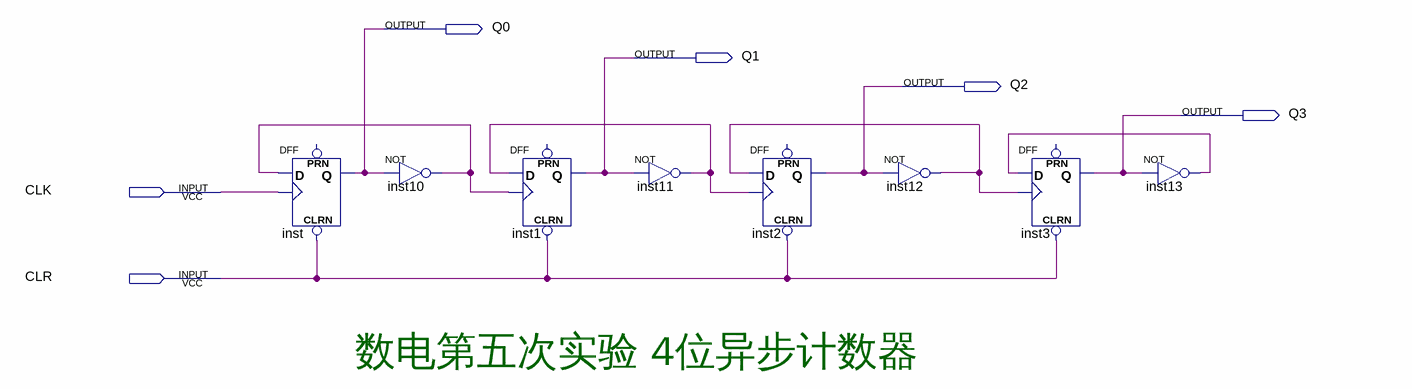
[diagram p0: schematic sheet]
// Quartus schematic 4bitybjsq.bdf as structural Verilog: 8 symbols, 6 pins
module \4bitybjsq  (
  input  CLK,
  input  CLR,
  output Q0,
  output Q1,
  output Q2,
  output Q3
);

  wire inst10_out, inst11_out, inst12_out, inst13_out;

  DFF inst (.CLRN(CLR), .CLK(CLK), .D(inst10_out), .Q(Q0));  // open: PRN
  not inst10 (inst10_out, Q0);
  DFF inst1 (.CLRN(CLR), .CLK(inst10_out), .D(inst11_out), .Q(Q1));  // open: PRN
  not inst11 (inst11_out, Q1);
  DFF inst2 (.CLRN(CLR), .CLK(inst11_out), .D(inst12_out), .Q(Q2));  // open: PRN
  not inst12 (inst12_out, Q2);
  DFF inst3 (.CLRN(CLR), .CLK(inst12_out), .D(inst13_out), .Q(Q3));  // open: PRN
  not inst13 (inst13_out, Q3);

  // Notes on the sheet:
  //   数电第五次实验 4位异步计数器
endmodule
